# Altium schematic sheet Reverse Polarity Protection.SchDoc
size A4
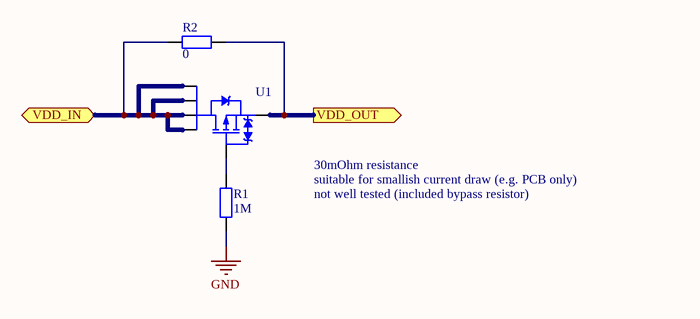
[diagram p0: Reverse Polarity Protection.SchDoc]

## Parts
R1  value 1M  [R0603]  (hidden comment: Res)
R2  value 0  [R0603]  (hidden comment: Res)
U1  MOSFET P FDC608PZ  [FDC608PZ]  (value not drawn)

## Ports
VDD_IN, VDD_OUT (out)

## Nets
GND: R1.1
VDD_IN: R2.1 U1.1(D) U1.2(D) U1.5(D) U1.6(D) ; port VDD_IN
VDD_OUT: R2.2 U1.4(S) ; port VDD_OUT
NetR1_2: R1.2 U1.3(G)

## Notes on the sheet
- 30mOhm resistance
- suitable for smallish current draw (e.g. PCB only)
- not well tested (included bypass resistor)

## Library data of the parts
R1 R2 = Res2: Resistor
  R1: farnell: 9330410
U1 = MOSFET P FDC608PZ: FAIRCHILD SEMICONDUCTOR - FDC608PZ - MOSFET, P, SMD, SSOT-6; farnell: 1495225